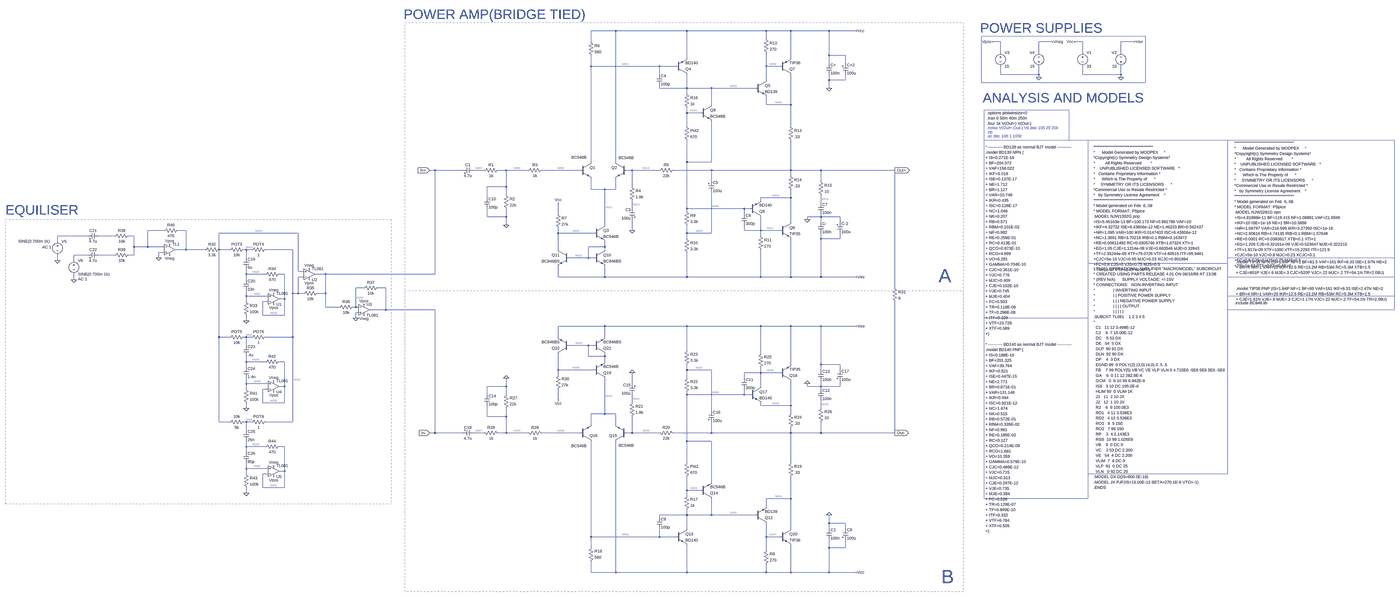
[diagram p0: schematic Draft2.asc, whole sheet]
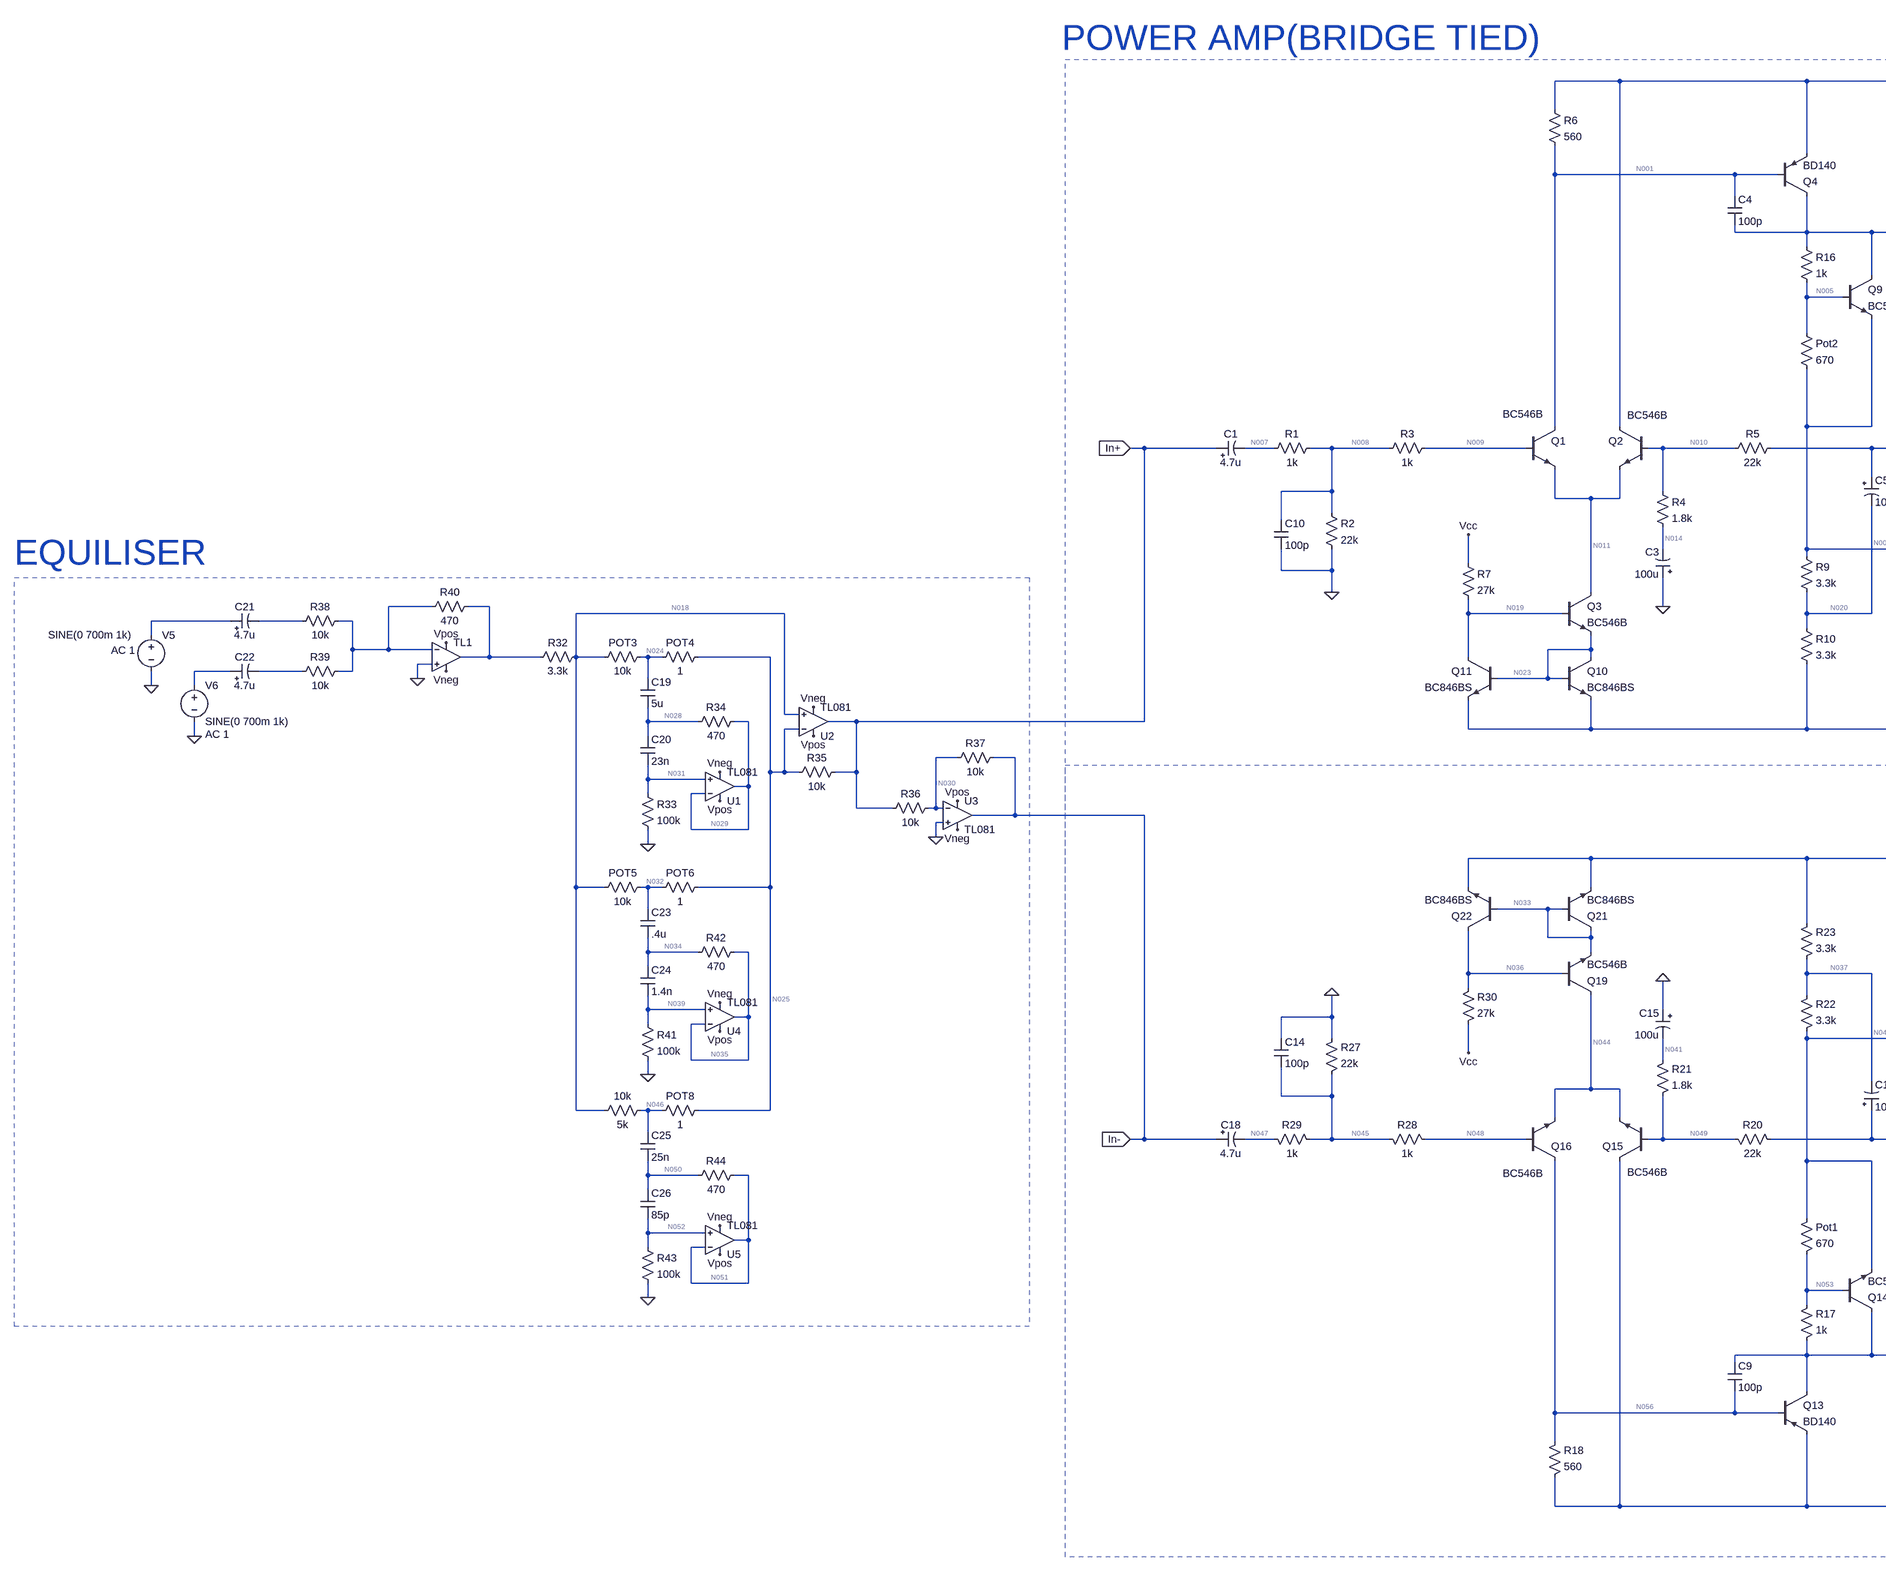
[diagram p1: schematic Draft2.asc, part, row 1 of 1, column 1 of 2]
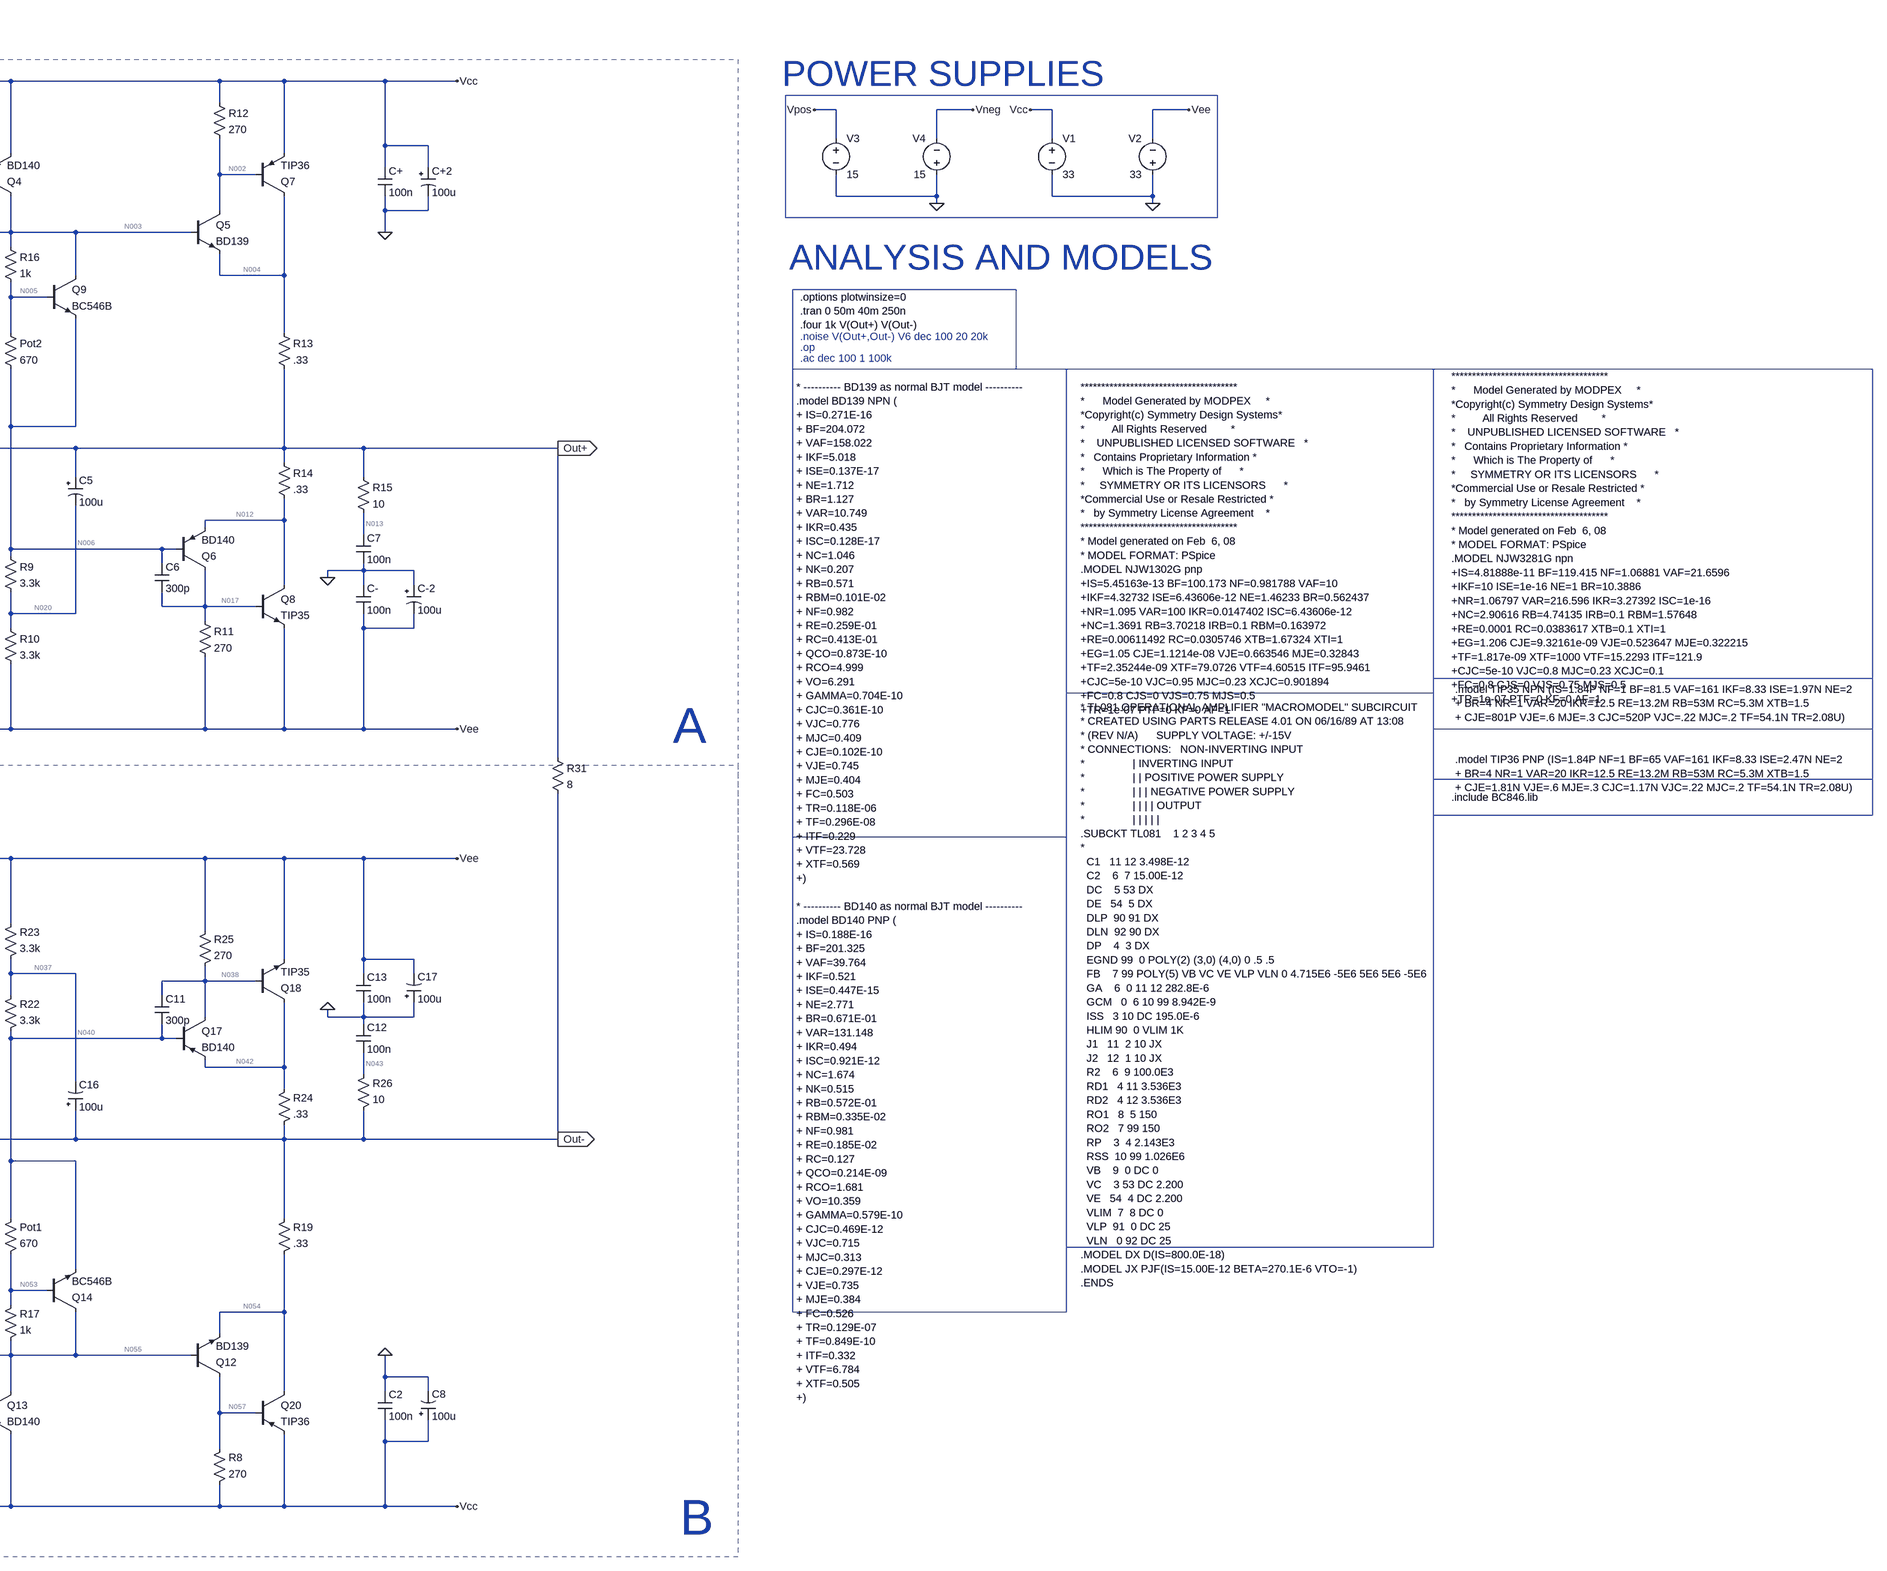
[diagram p2: schematic Draft2.asc, part, row 1 of 1, column 2 of 2]
Draft2.asc, the LTspice schematic file:
Version 4.1
SHEET 1 4540 4040
WIRE -1200 -144 -1344 -144
WIRE -784 -144 -1200 -144
WIRE -320 -144 -784 -144
WIRE -176 -144 -320 -144
WIRE 48 -144 -176 -144
WIRE 208 -144 48 -144
WIRE -320 -96 -320 -144
WIRE -1344 -80 -1344 -144
WIRE 1120 -80 1072 -80
WIRE 1424 -80 1344 -80
WIRE 1600 -80 1552 -80
WIRE 1904 -80 1824 -80
WIRE 1120 -16 1120 -80
WIRE 1344 -16 1344 -80
WIRE 1600 -16 1600 -80
WIRE 1824 -16 1824 -80
WIRE 48 0 48 -144
WIRE 144 0 48 0
WIRE -784 16 -784 -144
WIRE -176 16 -176 -144
WIRE 48 48 48 0
WIRE 144 48 144 0
WIRE -1344 64 -1344 0
WIRE -944 64 -1344 64
WIRE -848 64 -944 64
WIRE -320 64 -320 -16
WIRE -240 64 -320 64
WIRE -944 112 -944 64
WIRE 1120 112 1120 64
WIRE 1344 112 1344 64
WIRE 1344 112 1120 112
WIRE 1600 112 1600 64
WIRE 1824 112 1824 64
WIRE 1824 112 1600 112
WIRE 1344 128 1344 112
WIRE 1824 128 1824 112
WIRE -320 144 -320 64
WIRE 48 144 48 112
WIRE 144 144 144 112
WIRE 144 144 48 144
WIRE -944 192 -944 176
WIRE -784 192 -784 112
WIRE -784 192 -944 192
WIRE -640 192 -784 192
WIRE -384 192 -640 192
WIRE 48 192 48 144
WIRE -784 224 -784 192
WIRE -640 288 -640 192
WIRE -320 288 -320 240
WIRE -176 288 -176 112
WIRE -176 288 -320 288
WIRE -784 336 -784 304
WIRE -704 336 -784 336
WIRE -784 416 -784 336
WIRE -176 416 -176 288
WIRE -1344 624 -1344 64
WIRE -1200 624 -1200 -144
WIRE -784 624 -784 496
WIRE -640 624 -640 384
WIRE -640 624 -784 624
WIRE -2256 672 -2288 672
WIRE -2096 672 -2256 672
WIRE -1968 672 -2032 672
WIRE -1840 672 -1888 672
WIRE -1712 672 -1840 672
WIRE -1408 672 -1632 672
WIRE -1104 672 -1136 672
WIRE -944 672 -1104 672
WIRE -640 672 -864 672
WIRE -176 672 -176 496
WIRE -176 672 -640 672
WIRE 0 672 -176 672
WIRE 432 672 0 672
WIRE -176 704 -176 672
WIRE -640 736 -640 672
WIRE 0 736 0 672
WIRE -1840 768 -1840 672
WIRE -1840 768 -1952 768
WIRE -1104 768 -1104 672
WIRE -1344 784 -1344 720
WIRE -1264 784 -1344 784
WIRE -1200 784 -1200 720
WIRE -1200 784 -1264 784
WIRE -1840 816 -1840 768
WIRE -1952 832 -1952 768
WIRE -176 832 -176 784
WIRE -176 832 -352 832
WIRE -352 848 -352 832
WIRE 0 864 0 816
WIRE -1104 896 -1104 848
WIRE -784 896 -784 624
WIRE -448 896 -784 896
WIRE -416 896 -448 896
WIRE -784 912 -784 896
WIRE -1536 928 -1536 864
WIRE -448 928 -448 896
WIRE -1952 944 -1952 896
WIRE -1840 944 -1840 896
WIRE -1840 944 -1952 944
WIRE 0 944 0 928
WIRE 0 944 -80 944
WIRE 112 944 0 944
WIRE -80 960 -80 944
WIRE -176 976 -176 832
WIRE 0 976 0 944
WIRE 112 976 112 944
WIRE -1840 992 -1840 944
WIRE -1264 992 -1264 784
WIRE -3840 1024 -3936 1024
WIRE -3712 1024 -3760 1024
WIRE -1104 1024 -1104 960
WIRE -448 1024 -448 992
WIRE -352 1024 -352 944
WIRE -352 1024 -448 1024
WIRE -240 1024 -352 1024
WIRE -3056 1040 -3520 1040
WIRE -1536 1040 -1536 1008
WIRE -1328 1040 -1536 1040
WIRE -784 1040 -784 992
WIRE -640 1040 -640 800
WIRE -640 1040 -784 1040
WIRE -4288 1056 -4464 1056
WIRE -4128 1056 -4224 1056
WIRE -4016 1056 -4048 1056
WIRE -352 1056 -352 1024
WIRE -784 1072 -784 1040
WIRE 0 1072 0 1040
WIRE 112 1072 112 1040
WIRE 112 1072 0 1072
WIRE -4464 1088 -4464 1056
WIRE -4016 1120 -4016 1056
WIRE -3936 1120 -3936 1024
WIRE -3936 1120 -4016 1120
WIRE -3840 1120 -3936 1120
WIRE -1264 1120 -1264 1088
WIRE -1264 1120 -1360 1120
WIRE -3712 1136 -3712 1024
WIRE -3712 1136 -3776 1136
WIRE -3600 1136 -3712 1136
WIRE -3520 1136 -3520 1040
WIRE -3456 1136 -3520 1136
WIRE -3360 1136 -3376 1136
WIRE -3328 1136 -3360 1136
WIRE -3088 1136 -3248 1136
WIRE -1536 1136 -1536 1040
WIRE -1264 1136 -1264 1120
WIRE -3840 1152 -3872 1152
WIRE -4288 1168 -4368 1168
WIRE -4128 1168 -4224 1168
WIRE -4016 1168 -4016 1120
WIRE -4016 1168 -4048 1168
WIRE -3872 1184 -3872 1152
WIRE -3360 1184 -3360 1136
WIRE -1360 1184 -1360 1120
WIRE -1360 1184 -1472 1184
WIRE -1328 1184 -1360 1184
WIRE -4464 1200 -4464 1168
WIRE -4368 1200 -4368 1168
WIRE -3056 1264 -3056 1040
WIRE -3024 1264 -3056 1264
WIRE -3360 1280 -3360 1248
WIRE -3248 1280 -3360 1280
WIRE -3136 1280 -3168 1280
WIRE -2896 1280 -2960 1280
WIRE -2256 1280 -2256 672
WIRE -2256 1280 -2896 1280
WIRE -3024 1296 -3056 1296
WIRE -1536 1296 -1536 1232
WIRE -1264 1296 -1264 1232
WIRE -1264 1296 -1536 1296
WIRE -784 1296 -784 1152
WIRE -784 1296 -1264 1296
WIRE -352 1296 -352 1136
WIRE -352 1296 -784 1296
WIRE -176 1296 -176 1072
WIRE -176 1296 -352 1296
WIRE 0 1296 0 1072
WIRE 0 1296 -176 1296
WIRE 208 1296 0 1296
WIRE -4368 1312 -4368 1280
WIRE -3360 1312 -3360 1280
WIRE -2672 1360 -2720 1360
WIRE -2544 1360 -2592 1360
WIRE 432 1360 432 672
WIRE -3088 1392 -3088 1136
WIRE -3056 1392 -3056 1296
WIRE -3056 1392 -3088 1392
WIRE -3024 1392 -3056 1392
WIRE -2896 1392 -2896 1280
WIRE -2896 1392 -2944 1392
WIRE -3360 1408 -3360 1376
WIRE -3232 1408 -3360 1408
WIRE -3136 1424 -3136 1280
WIRE -3136 1424 -3168 1424
WIRE -3360 1440 -3360 1408
WIRE -3232 1440 -3264 1440
WIRE -2896 1472 -2896 1392
WIRE -2816 1472 -2896 1472
WIRE -2720 1472 -2720 1360
WIRE -2720 1472 -2736 1472
WIRE -2704 1472 -2720 1472
WIRE -2544 1488 -2544 1360
WIRE -2544 1488 -2640 1488
WIRE -2256 1488 -2544 1488
WIRE -2704 1504 -2720 1504
WIRE -3264 1520 -3264 1440
WIRE -3136 1520 -3136 1424
WIRE -3136 1520 -3264 1520
WIRE -2720 1536 -2720 1504
WIRE -3360 1552 -3360 1520
WIRE -1264 1584 -1536 1584
WIRE -784 1584 -1264 1584
WIRE -352 1584 -784 1584
WIRE -176 1584 -352 1584
WIRE 0 1584 -176 1584
WIRE 208 1584 0 1584
WIRE -3520 1648 -3520 1136
WIRE -3456 1648 -3520 1648
WIRE -3360 1648 -3376 1648
WIRE -3328 1648 -3360 1648
WIRE -3088 1648 -3088 1392
WIRE -3088 1648 -3248 1648
WIRE -1536 1648 -1536 1584
WIRE -1264 1648 -1264 1584
WIRE -3360 1696 -3360 1648
WIRE -1360 1696 -1472 1696
WIRE -1328 1696 -1360 1696
WIRE -784 1728 -784 1584
WIRE -352 1744 -352 1584
WIRE -1360 1760 -1360 1696
WIRE -1264 1760 -1264 1744
WIRE -1264 1760 -1360 1760
WIRE -3360 1792 -3360 1760
WIRE -3248 1792 -3360 1792
WIRE -3136 1792 -3168 1792
WIRE -1264 1792 -1264 1760
WIRE -176 1808 -176 1584
WIRE 0 1808 0 1584
WIRE 112 1808 0 1808
WIRE -3360 1824 -3360 1792
WIRE -1536 1840 -1536 1744
WIRE -1328 1840 -1536 1840
WIRE -784 1840 -784 1808
WIRE -640 1840 -784 1840
WIRE 0 1840 0 1808
WIRE 112 1840 112 1808
WIRE -352 1856 -352 1824
WIRE -352 1856 -448 1856
WIRE -240 1856 -352 1856
WIRE -1536 1872 -1536 1840
WIRE -784 1888 -784 1840
WIRE -448 1888 -448 1856
WIRE -3360 1920 -3360 1888
WIRE -3232 1920 -3360 1920
WIRE -1104 1920 -1104 1856
WIRE -3136 1936 -3136 1792
WIRE -3136 1936 -3168 1936
WIRE -1840 1936 -1840 1888
WIRE -1840 1936 -1952 1936
WIRE -352 1936 -352 1856
WIRE -80 1936 -80 1920
WIRE 0 1936 0 1904
WIRE 0 1936 -80 1936
WIRE 112 1936 112 1904
WIRE 112 1936 0 1936
WIRE -3360 1952 -3360 1920
WIRE -3232 1952 -3264 1952
WIRE 0 1952 0 1936
WIRE -1952 1984 -1952 1936
WIRE -1840 1984 -1840 1936
WIRE -784 1984 -784 1968
WIRE -448 1984 -448 1952
WIRE -448 1984 -784 1984
WIRE -416 1984 -448 1984
WIRE -1536 2016 -1536 1952
WIRE -3264 2032 -3264 1952
WIRE -3136 2032 -3136 1936
WIRE -3136 2032 -3264 2032
WIRE -1104 2032 -1104 1984
WIRE -352 2048 -352 2032
WIRE -176 2048 -176 1904
WIRE -176 2048 -352 2048
WIRE -3360 2064 -3360 2032
WIRE 0 2064 0 2016
WIRE -640 2080 -640 1840
WIRE -1264 2096 -1264 1888
WIRE -1264 2096 -1344 2096
WIRE -1200 2096 -1264 2096
WIRE -176 2096 -176 2048
WIRE -1952 2112 -1952 2048
WIRE -1840 2112 -1840 2064
WIRE -1840 2112 -1952 2112
WIRE -3520 2144 -3520 1648
WIRE -3456 2144 -3520 2144
WIRE -3360 2144 -3376 2144
WIRE -3328 2144 -3360 2144
WIRE -3088 2144 -3088 1648
WIRE -3088 2144 -3248 2144
WIRE -1344 2160 -1344 2096
WIRE -1200 2160 -1200 2096
WIRE -3360 2192 -3360 2144
WIRE -2256 2208 -2256 1488
WIRE -2256 2208 -2288 2208
WIRE -2096 2208 -2256 2208
WIRE -1968 2208 -2032 2208
WIRE -1840 2208 -1840 2112
WIRE -1840 2208 -1888 2208
WIRE -1712 2208 -1840 2208
WIRE -1408 2208 -1632 2208
WIRE -1104 2208 -1104 2112
WIRE -1104 2208 -1136 2208
WIRE -944 2208 -1104 2208
WIRE -640 2208 -640 2144
WIRE -640 2208 -864 2208
WIRE -176 2208 -176 2176
WIRE -176 2208 -640 2208
WIRE 0 2208 0 2144
WIRE 0 2208 -176 2208
WIRE 432 2208 432 1440
WIRE 432 2208 0 2208
WIRE -784 2256 -784 1984
WIRE -640 2256 -784 2256
WIRE -3360 2288 -3360 2256
WIRE -3248 2288 -3360 2288
WIRE -3136 2288 -3168 2288
WIRE -3360 2320 -3360 2288
WIRE -784 2384 -784 2256
WIRE -176 2384 -176 2208
WIRE -3360 2416 -3360 2384
WIRE -3232 2416 -3360 2416
WIRE -3136 2432 -3136 2288
WIRE -3136 2432 -3168 2432
WIRE -3360 2448 -3360 2416
WIRE -3232 2448 -3264 2448
WIRE -640 2496 -640 2256
WIRE -3264 2528 -3264 2448
WIRE -3136 2528 -3136 2432
WIRE -3136 2528 -3264 2528
WIRE -784 2544 -784 2464
WIRE -704 2544 -784 2544
WIRE -3360 2560 -3360 2528
WIRE -784 2576 -784 2544
WIRE -176 2592 -176 2464
WIRE -176 2592 -320 2592
WIRE -320 2640 -320 2592
WIRE -784 2688 -784 2656
WIRE -784 2688 -944 2688
WIRE -640 2688 -640 2592
WIRE -640 2688 -784 2688
WIRE -384 2688 -640 2688
WIRE -944 2704 -944 2688
WIRE 48 2736 48 2688
WIRE 144 2736 48 2736
WIRE -784 2768 -784 2688
WIRE -176 2768 -176 2592
WIRE 48 2768 48 2736
WIRE 144 2768 144 2736
WIRE -1344 2816 -1344 2256
WIRE -944 2816 -944 2768
WIRE -944 2816 -1344 2816
WIRE -848 2816 -944 2816
WIRE -320 2816 -320 2736
WIRE -240 2816 -320 2816
WIRE -1344 2880 -1344 2816
WIRE 48 2880 48 2832
WIRE 144 2880 144 2832
WIRE 144 2880 48 2880
WIRE -320 2896 -320 2816
WIRE -1344 3024 -1344 2960
WIRE -1200 3024 -1200 2256
WIRE -1200 3024 -1344 3024
WIRE -784 3024 -784 2864
WIRE -784 3024 -1200 3024
WIRE -320 3024 -320 2976
WIRE -320 3024 -784 3024
WIRE -176 3024 -176 2864
WIRE -176 3024 -320 3024
WIRE 48 3024 48 2880
WIRE 48 3024 -176 3024
WIRE 208 3024 48 3024
FLAG 48 192 0
FLAG 208 -144 Vcc
FLAG -1104 1024 0
FLAG 432 672 Out+
IOPIN 432 672 Out
FLAG -80 960 0
FLAG 208 1296 Vee
FLAG -1840 992 0
FLAG -2288 672 In+
IOPIN -2288 672 In
FLAG 1824 128 0
FLAG 1552 -80 Vcc
FLAG 1904 -80 Vee
FLAG -1536 864 Vcc
FLAG 48 2688 0
FLAG 208 3024 Vcc
FLAG -1104 1856 0
FLAG -80 1920 0
FLAG 208 1584 Vee
FLAG -1840 1888 0
FLAG -1536 2016 Vcc
FLAG 432 2208 Out-
IOPIN 432 2208 Out
FLAG 1344 128 0
FLAG 1072 -80 Vpos
FLAG 1424 -80 Vneg
FLAG -2288 2208 In-
IOPIN -2288 2208 In
FLAG -3360 1552 0
FLAG -3200 1392 Vneg
FLAG -2992 1248 Vneg
FLAG -3200 1456 Vpos
FLAG -2992 1312 Vpos
FLAG -2672 1456 Vpos
FLAG -2672 1520 Vneg
FLAG -2720 1536 0
FLAG -4464 1200 0
FLAG -4368 1312 0
FLAG -3872 1184 0
FLAG -3808 1104 Vpos
FLAG -3808 1168 Vneg
FLAG -3360 2064 0
FLAG -3200 1904 Vneg
FLAG -3200 1968 Vpos
FLAG -3360 2560 0
FLAG -3200 2400 Vneg
FLAG -3200 2464 Vpos
DATAFLAG -176 368 ""
DATAFLAG -176 800 ""
DATAFLAG -64 672 ""
DATAFLAG -176 2512 ""
DATAFLAG -176 2080 ""
DATAFLAG -64 2208 ""
SYMBOL cap 32 48 R0
SYMATTR InstName C+
SYMATTR Value 100n
SYMBOL polcap 128 48 R0
SYMATTR InstName C+2
SYMATTR Value 100u
SYMBOL npn -384 144 R0
SYMATTR InstName Q5
SYMATTR Value BD139
SYMBOL res -336 -112 R0
SYMATTR InstName R12
SYMATTR Value 270
SYMATTR SpiceLine tol=5
SYMBOL pnp -848 112 M180
SYMATTR InstName Q4
SYMATTR Value BD140
SYMBOL npn -704 288 R0
SYMATTR InstName Q9
SYMATTR Value BC546B
SYMBOL res -800 208 R0
SYMATTR InstName R16
SYMATTR Value 1k
SYMATTR SpiceLine tol=5
SYMBOL res -800 400 R0
SYMATTR InstName Pot2
SYMATTR Value 670
SYMBOL cap -960 112 R0
SYMATTR InstName C4
SYMATTR Value 100p
SYMBOL res -1360 -96 R0
SYMATTR InstName R6
SYMATTR Value 560
SYMATTR SpiceLine tol=5
SYMBOL res -192 400 R0
SYMATTR InstName R13
SYMATTR Value .33
SYMBOL res -848 656 R90
WINDOW 0 0 56 VBottom 2
WINDOW 3 32 56 VTop 2
SYMATTR InstName R5
SYMATTR Value 22k
SYMATTR SpiceLine tol=5
SYMBOL npn -1136 624 M0
WINDOW 3 -42 -25 Left 2
SYMATTR Value BC546B
SYMATTR InstName Q2
SYMBOL npn -1408 624 R0
WINDOW 3 -52 -28 Left 2
SYMATTR Value BC546B
SYMATTR InstName Q1
SYMBOL res -1120 752 R0
SYMATTR InstName R4
SYMATTR Value 1.8k
SYMATTR SpiceLine tol=5
SYMBOL res -800 896 R0
SYMATTR InstName R9
SYMATTR Value 3.3k
SYMATTR SpiceLine tol=5
SYMBOL res -800 1056 R0
SYMATTR InstName R10
SYMATTR Value 3.3k
SYMATTR SpiceLine tol=5
SYMBOL pnp -416 944 M180
SYMATTR InstName Q6
SYMATTR Value BD140
SYMBOL cap -464 928 R0
SYMATTR InstName C6
SYMATTR Value 300p
SYMBOL res -192 688 R0
SYMATTR InstName R14
SYMATTR Value .33
SYMBOL npn -240 976 R0
SYMATTR InstName Q8
SYMATTR Value TIP35
SYMBOL res -368 1040 R0
SYMATTR InstName R11
SYMATTR Value 270
SYMATTR SpiceLine tol=5
SYMBOL res -16 720 R0
SYMATTR InstName R15
SYMATTR Value 10
SYMBOL cap -16 864 R0
SYMATTR InstName C7
SYMATTR Value 100n
SYMBOL cap -16 976 R0
SYMATTR InstName C-
SYMATTR Value 100n
SYMBOL npn -1328 992 R0
SYMATTR InstName Q3
SYMATTR Value BC546B
SYMBOL res -1856 800 R0
SYMATTR InstName R2
SYMATTR Value 22k
SYMATTR SpiceLine tol=5
SYMBOL res -1616 656 R90
WINDOW 0 0 56 VBottom 2
WINDOW 3 32 56 VTop 2
SYMATTR InstName R3
SYMATTR Value 1k
SYMATTR SpiceLine tol=5
SYMBOL cap -1968 832 R0
SYMATTR InstName C10
SYMATTR Value 100p
SYMBOL res -1872 656 R90
WINDOW 0 0 56 VBottom 2
WINDOW 3 32 56 VTop 2
SYMATTR InstName R1
SYMATTR Value 1k
SYMATTR SpiceLine tol=5
SYMBOL polcap -1088 960 R180
WINDOW 0 24 57 Left 2
WINDOW 3 24 8 Left 2
SYMATTR InstName C3
SYMATTR Value 100u
SYMBOL polcap -656 736 R0
SYMATTR InstName C5
SYMATTR Value 100u
SYMBOL polcap 96 976 R0
SYMATTR InstName C-2
SYMATTR Value 100u
SYMBOL voltage 1600 -32 R0
WINDOW 123 0 0 Left 0
WINDOW 39 0 0 Left 0
SYMATTR InstName V1
SYMATTR Value 33
SYMBOL voltage 1824 80 R180
WINDOW 0 24 96 Left 2
WINDOW 3 24 16 Left 2
WINDOW 123 0 0 Left 0
WINDOW 39 0 0 Left 0
SYMATTR InstName V2
SYMATTR Value 33
SYMBOL pnp -240 112 M180
SYMATTR InstName Q7
SYMATTR Value TIP36
SYMBOL polcap -2096 688 R270
WINDOW 0 32 32 VTop 2
WINDOW 3 0 32 VBottom 2
SYMATTR InstName C1
SYMATTR Value 4.7u
SYMBOL npn -1328 1136 R0
SYMATTR InstName Q10
SYMATTR Value BC846BS
SYMATTR Prefix X
SYMBOL npn -1472 1136 M0
SYMATTR InstName Q11
SYMATTR Value BC846BS
SYMATTR Prefix X
SYMBOL res -1552 912 R0
SYMATTR InstName R7
SYMATTR Value 27k
SYMATTR SpiceLine tol=5
SYMBOL cap 32 2832 M180
WINDOW 0 24 56 Left 2
WINDOW 3 24 8 Left 2
SYMATTR InstName C2
SYMATTR Value 100n
SYMBOL polcap 128 2832 M180
WINDOW 0 24 57 Left 2
WINDOW 3 24 8 Left 2
SYMATTR InstName C8
SYMATTR Value 100u
SYMBOL npn -384 2736 M180
SYMATTR InstName Q12
SYMATTR Value BD139
SYMBOL res -336 2992 M180
WINDOW 0 36 76 Left 2
WINDOW 3 36 40 Left 2
SYMATTR InstName R8
SYMATTR Value 270
SYMATTR SpiceLine tol=5
SYMBOL pnp -848 2768 R0
SYMATTR InstName Q13
SYMATTR Value BD140
SYMBOL npn -704 2592 M180
SYMATTR InstName Q14
SYMATTR Value BC546B
SYMBOL res -800 2672 M180
WINDOW 0 36 76 Left 2
WINDOW 3 36 40 Left 2
SYMATTR InstName R17
SYMATTR Value 1k
SYMATTR SpiceLine tol=5
SYMBOL res -800 2480 M180
WINDOW 0 36 76 Left 2
WINDOW 3 36 40 Left 2
SYMATTR InstName Pot1
SYMATTR Value 670
SYMBOL cap -960 2768 M180
WINDOW 0 24 56 Left 2
WINDOW 3 24 8 Left 2
SYMATTR InstName C9
SYMATTR Value 100p
SYMBOL res -1360 2976 M180
WINDOW 0 36 76 Left 2
WINDOW 3 36 40 Left 2
SYMATTR InstName R18
SYMATTR Value 560
SYMATTR SpiceLine tol=5
SYMBOL res -192 2480 M180
WINDOW 0 36 76 Left 2
WINDOW 3 36 40 Left 2
SYMATTR InstName R19
SYMATTR Value .33
SYMBOL res -848 2224 M270
WINDOW 0 32 56 VTop 2
WINDOW 3 0 56 VBottom 2
SYMATTR InstName R20
SYMATTR Value 22k
SYMBOL npn -1136 2256 R180
WINDOW 3 -42 -25 Left 2
SYMATTR Value BC546B
SYMATTR InstName Q15
SYMBOL npn -1408 2256 M180
WINDOW 3 -52 -28 Left 2
SYMATTR Value BC546B
SYMATTR InstName Q16
SYMBOL res -1120 2128 M180
WINDOW 0 36 76 Left 2
WINDOW 3 36 40 Left 2
SYMATTR InstName R21
SYMATTR Value 1.8k
SYMATTR SpiceLine tol=5
SYMBOL res -800 1984 M180
WINDOW 0 36 76 Left 2
WINDOW 3 36 40 Left 2
SYMATTR InstName R22
SYMATTR Value 3.3k
SYMATTR SpiceLine tol=5
SYMBOL res -800 1824 M180
WINDOW 0 36 76 Left 2
WINDOW 3 36 40 Left 2
SYMATTR InstName R23
SYMATTR Value 3.3k
SYMATTR SpiceLine tol=5
SYMBOL pnp -416 1936 R0
SYMATTR InstName Q17
SYMATTR Value BD140
SYMBOL cap -464 1952 M180
WINDOW 0 24 56 Left 2
WINDOW 3 24 8 Left 2
SYMATTR InstName C11
SYMATTR Value 300p
SYMBOL res -192 2192 M180
WINDOW 0 36 76 Left 2
WINDOW 3 36 40 Left 2
SYMATTR InstName R24
SYMATTR Value .33
SYMBOL npn -240 1904 M180
SYMATTR InstName Q18
SYMATTR Value TIP35
SYMBOL res -368 1840 M180
WINDOW 0 36 76 Left 2
WINDOW 3 36 40 Left 2
SYMATTR InstName R25
SYMATTR Value 270
SYMATTR SpiceLine tol=5
SYMBOL res -16 2160 M180
WINDOW 0 36 76 Left 2
WINDOW 3 36 40 Left 2
SYMATTR InstName R26
SYMATTR Value 10
SYMBOL cap -16 2016 M180
WINDOW 0 24 56 Left 2
WINDOW 3 24 8 Left 2
SYMATTR InstName C12
SYMATTR Value 100n
SYMBOL cap -16 1904 M180
WINDOW 0 24 56 Left 2
WINDOW 3 24 8 Left 2
SYMATTR InstName C13
SYMATTR Value 100n
SYMBOL npn -1328 1888 M180
SYMATTR InstName Q19
SYMATTR Value BC546B
SYMBOL res -1856 2080 M180
WINDOW 0 36 76 Left 2
WINDOW 3 36 40 Left 2
SYMATTR InstName R27
SYMATTR Value 22k
SYMATTR SpiceLine tol=5
SYMBOL res -1616 2224 M270
WINDOW 0 32 56 VTop 2
WINDOW 3 0 56 VBottom 2
SYMATTR InstName R28
SYMATTR Value 1k
SYMATTR SpiceLine tol=5
SYMBOL cap -1968 2048 M180
WINDOW 0 24 56 Left 2
WINDOW 3 24 8 Left 2
SYMATTR InstName C14
SYMATTR Value 100p
SYMBOL res -1872 2224 M270
WINDOW 0 32 56 VTop 2
WINDOW 3 0 56 VBottom 2
SYMATTR InstName R29
SYMATTR Value 1k
SYMATTR SpiceLine tol=5
SYMBOL polcap -1088 1920 M0
SYMATTR InstName C15
SYMATTR Value 100u
SYMBOL polcap -656 2144 M180
WINDOW 0 24 57 Left 2
WINDOW 3 24 8 Left 2
SYMATTR InstName C16
SYMATTR Value 100u
SYMBOL polcap 96 1904 M180
WINDOW 0 24 57 Left 2
WINDOW 3 24 8 Left 2
SYMATTR InstName C17
SYMATTR Value 100u
SYMBOL pnp -240 2768 R0
SYMATTR InstName Q20
SYMATTR Value TIP36
SYMBOL polcap -2096 2192 M90
WINDOW 0 0 32 VBottom 2
WINDOW 3 32 32 VTop 2
SYMATTR InstName C18
SYMATTR Value 4.7u
SYMBOL npn -1328 1744 M180
SYMATTR InstName Q21
SYMATTR Value BC846BS
SYMATTR Prefix X
SYMBOL npn -1472 1744 R180
SYMATTR InstName Q22
SYMATTR Value BC846BS
SYMATTR Prefix X
SYMBOL res -1552 1968 M180
WINDOW 0 36 76 Left 2
WINDOW 3 36 40 Left 2
SYMATTR InstName R30
SYMATTR Value 27k
SYMATTR SpiceLine tol=5
SYMBOL res 416 1344 R0
SYMATTR InstName R31
SYMATTR Value 8
SYMBOL voltage 1120 -32 R0
WINDOW 123 0 0 Left 0
WINDOW 39 0 0 Left 0
SYMATTR InstName V3
SYMATTR Value 15
SYMBOL voltage 1344 80 R180
WINDOW 0 24 96 Left 2
WINDOW 3 24 16 Left 2
WINDOW 123 0 0 Left 0
WINDOW 39 0 0 Left 0
SYMATTR InstName V4
SYMATTR Value 15
SYMBOL res -3504 1120 R90
WINDOW 0 0 56 VBottom 2
WINDOW 3 32 56 VTop 2
SYMATTR InstName R32
SYMATTR Value 3.3k
SYMATTR SpiceLine tol=5
SYMBOL res -3360 1120 R90
WINDOW 0 0 56 VBottom 2
WINDOW 3 32 56 VTop 2
SYMATTR InstName POT3
SYMATTR Value 10k
SYMBOL res -3232 1120 R90
WINDOW 0 0 56 VBottom 2
WINDOW 3 32 56 VTop 2
SYMATTR InstName POT4
SYMATTR Value 1
SYMBOL cap -3376 1184 R0
SYMATTR InstName C19
SYMATTR Value 5u
SYMBOL cap -3376 1312 R0
SYMATTR InstName C20
SYMATTR Value 23n
SYMBOL res -3376 1424 R0
SYMATTR InstName R33
SYMATTR Value 100k
SYMBOL res -3152 1264 R90
WINDOW 0 0 56 VBottom 2
WINDOW 3 32 56 VTop 2
SYMATTR InstName R34
SYMATTR Value 470
SYMATTR SpiceLine tol=5
SYMBOL res -2928 1376 R90
WINDOW 0 0 56 VBottom 2
WINDOW 3 32 56 VTop 2
SYMATTR InstName R35
SYMATTR Value 10k
SYMBOL OpAmps\\opamp2 -3200 1488 M180
SYMATTR InstName U1
SYMATTR Value TL081
SYMBOL OpAmps\\opamp2 -2992 1344 M180
SYMATTR InstName U2
SYMATTR Value TL081
SYMBOL OpAmps\\opamp2 -2672 1424 R0
SYMATTR InstName U3
SYMATTR Value TL081
SYMBOL res -2720 1456 R90
WINDOW 0 0 56 VBottom 2
WINDOW 3 32 56 VTop 2
SYMATTR InstName R36
SYMATTR Value 10k
SYMATTR SpiceLine tol=5
SYMBOL res -2576 1344 R90
WINDOW 0 0 56 VBottom 2
WINDOW 3 32 56 VTop 2
SYMATTR InstName R37
SYMATTR Value 10k
SYMATTR SpiceLine tol=5
SYMBOL voltage -4464 1072 R0
WINDOW 3 -229 15 Left 2
WINDOW 123 -89 49 Left 2
WINDOW 39 0 0 Left 0
SYMATTR Value SINE(0 700m 1k)
SYMATTR Value2 AC 1
SYMATTR InstName V5
SYMBOL voltage -4368 1184 R0
WINDOW 123 24 124 Left 2
WINDOW 39 0 0 Left 0
SYMATTR Value2 AC 1
SYMATTR InstName V6
SYMATTR Value SINE(0 700m 1k)
SYMBOL polcap -4288 1072 R270
WINDOW 0 32 32 VTop 2
WINDOW 3 0 32 VBottom 2
SYMATTR InstName C21
SYMATTR Value 4.7u
SYMBOL polcap -4288 1184 R270
WINDOW 0 32 32 VTop 2
WINDOW 3 0 32 VBottom 2
SYMATTR InstName C22
SYMATTR Value 4.7u
SYMBOL res -4032 1040 R90
WINDOW 0 0 56 VBottom 2
WINDOW 3 32 56 VTop 2
SYMATTR InstName R38
SYMATTR Value 10k
SYMATTR SpiceLine tol=5
SYMBOL res -4032 1152 R90
WINDOW 0 0 56 VBottom 2
WINDOW 3 32 56 VTop 2
SYMATTR InstName R39
SYMATTR Value 10k
SYMATTR SpiceLine tol=5
SYMBOL OpAmps\\UniversalOpAmp2 -3808 1136 R0
SYMATTR InstName TL1
SYMBOL res -3744 1008 R90
WINDOW 0 0 56 VBottom 2
WINDOW 3 32 56 VTop 2
SYMATTR InstName R40
SYMATTR Value 470
SYMATTR SpiceLine tol=5
SYMBOL res -3360 1632 R90
WINDOW 0 0 56 VBottom 2
WINDOW 3 32 56 VTop 2
SYMATTR InstName POT5
SYMATTR Value 10k
SYMBOL res -3232 1632 R90
WINDOW 0 0 56 VBottom 2
WINDOW 3 32 56 VTop 2
SYMATTR InstName POT6
SYMATTR Value 1
SYMBOL cap -3376 1696 R0
SYMATTR InstName C23
SYMATTR Value .4u
SYMBOL cap -3376 1824 R0
SYMATTR InstName C24
SYMATTR Value 1.4n
SYMBOL res -3376 1936 R0
SYMATTR InstName R41
SYMATTR Value 100k
SYMBOL res -3152 1776 R90
WINDOW 0 0 56 VBottom 2
WINDOW 3 32 56 VTop 2
SYMATTR InstName R42
SYMATTR Value 470
SYMATTR SpiceLine tol=5
SYMBOL OpAmps\\opamp2 -3200 2000 M180
SYMATTR InstName U4
SYMATTR Value TL081
SYMBOL res -3360 2128 R90
WINDOW 0 0 56 VBottom 2
WINDOW 3 32 56 VTop 2
SYMATTR InstName 10k
SYMATTR Value 5k
SYMBOL res -3232 2128 R90
WINDOW 0 0 56 VBottom 2
WINDOW 3 32 56 VTop 2
SYMATTR InstName POT8
SYMATTR Value 1
SYMBOL cap -3376 2192 R0
SYMATTR InstName C25
SYMATTR Value 25n
SYMBOL cap -3376 2320 R0
SYMATTR InstName C26
SYMATTR Value 85p
SYMBOL res -3376 2432 R0
SYMATTR InstName R43
SYMATTR Value 100k
SYMBOL res -3152 2272 R90
WINDOW 0 0 56 VBottom 2
WINDOW 3 32 56 VTop 2
SYMATTR InstName R44
SYMATTR Value 470
SYMATTR SpiceLine tol=5
SYMBOL OpAmps\\opamp2 -3200 2496 M180
SYMATTR InstName U5
SYMATTR Value TL081
TEXT 2496 1208 Left 2 !.model TIP35 NPN (IS=1.84P NF=1 BF=81.5 VAF=161 IKF=8.33 ISE=1.97N NE=2\n+ BR=4 NR=1 VAR=20 IKR=12.5 RE=13.2M RB=53M RC=5.3M XTB=1.5\n+ CJE=801P VJE=.6 MJE=.3 CJC=520P VJC=.22 MJC=.2 TF=54.1N TR=2.08U)\n \n\n.model TIP36 PNP (IS=1.84P NF=1 BF=65 VAF=161 IKF=8.33 ISE=2.47N NE=2\n+ BR=4 NR=1 VAR=20 IKR=12.5 RE=13.2M RB=53M RC=5.3M XTB=1.5\n+ CJE=1.81N VJE=.6 MJE=.3 CJC=1.17N VJC=.22 MJC=.2 TF=54.1N TR=2.08U)
TEXT 1032 536 Left 2 !* ---------- BD139 as normal BJT model ----------\n.model BD139 NPN (\n+ IS=0.271E-16\n+ BF=204.072\n+ VAF=158.022\n+ IKF=5.018\n+ ISE=0.137E-17\n+ NE=1.712\n+ BR=1.127\n+ VAR=10.749\n+ IKR=0.435\n+ ISC=0.128E-17\n+ NC=1.046\n+ NK=0.207\n+ RB=0.571\n+ RBM=0.101E-02\n+ NF=0.982\n+ RE=0.259E-01\n+ RC=0.413E-01\n+ QCO=0.873E-10\n+ RCO=4.999\n+ VO=6.291\n+ GAMMA=0.704E-10\n+ CJC=0.361E-10\n+ VJC=0.776\n+ MJC=0.409\n+ CJE=0.102E-10\n+ VJE=0.745\n+ MJE=0.404\n+ FC=0.503\n+ TR=0.118E-06\n+ TF=0.296E-08\n+ ITF=0.229\n+ VTF=23.728\n+ XTF=0.569\n+)\n \n* ---------- BD140 as normal BJT model ----------\n.model BD140 PNP (\n+ IS=0.188E-16\n+ BF=201.325\n+ VAF=39.764\n+ IKF=0.521\n+ ISE=0.447E-15\n+ NE=2.771\n+ BR=0.671E-01\n+ VAR=131.148\n+ IKR=0.494\n+ ISC=0.921E-12\n+ NC=1.674\n+ NK=0.515\n+ RB=0.572E-01\n+ RBM=0.335E-02\n+ NF=0.981\n+ RE=0.185E-02\n+ RC=0.127\n+ QCO=0.214E-09\n+ RCO=1.681\n+ VO=10.359\n+ GAMMA=0.579E-10\n+ CJC=0.469E-12\n+ VJC=0.715\n+ MJC=0.313\n+ CJE=0.297E-12\n+ VJE=0.735\n+ MJE=0.384\n+ FC=0.526\n+ TR=0.129E-07\n+ TF=0.849E-10\n+ ITF=0.332\n+ VTF=6.784\n+ XTF=0.505\n+)
TEXT 1040 472 Left 2 ;.ac dec 100 1 100k
TEXT 2488 1448 Left 2 !.include BC846.lib
TEXT 1664 536 Left 2 !**************************************\n*      Model Generated by MODPEX     *\n*Copyright(c) Symmetry Design Systems*\n*         All Rights Reserved        *\n*    UNPUBLISHED LICENSED SOFTWARE   *\n*   Contains Proprietary Information *\n*      Which is The Property of      *\n*     SYMMETRY OR ITS LICENSORS      *\n*Commercial Use or Resale Restricted *\n*   by Symmetry License Agreement    *\n**************************************\n* Model generated on Feb  6, 08\n* MODEL FORMAT: PSpice\n.MODEL NJW1302G pnp\n+IS=5.45163e-13 BF=100.173 NF=0.981788 VAF=10\n+IKF=4.32732 ISE=6.43606e-12 NE=1.46233 BR=0.562437\n+NR=1.095 VAR=100 IKR=0.0147402 ISC=6.43606e-12\n+NC=1.3691 RB=3.70218 IRB=0.1 RBM=0.163972\n+RE=0.00611492 RC=0.0305746 XTB=1.67324 XTI=1\n+EG=1.05 CJE=1.1214e-08 VJE=0.663546 MJE=0.32843\n+TF=2.35244e-09 XTF=79.0726 VTF=4.60515 ITF=95.9461\n+CJC=5e-10 VJC=0.95 MJC=0.23 XCJC=0.901894\n+FC=0.8 CJS=0 VJS=0.75 MJS=0.5\n+TR=1e-07 PTF=0 KF=0 AF=1
TEXT 2488 512 Left 2 !**************************************\n*      Model Generated by MODPEX     *\n*Copyright(c) Symmetry Design Systems*\n*         All Rights Reserved        *\n*    UNPUBLISHED LICENSED SOFTWARE   *\n*   Contains Proprietary Information *\n*      Which is The Property of      *\n*     SYMMETRY OR ITS LICENSORS      *\n*Commercial Use or Resale Restricted *\n*   by Symmetry License Agreement    *\n**************************************\n* Model generated on Feb  6, 08\n* MODEL FORMAT: PSpice\n.MODEL NJW3281G npn\n+IS=4.81888e-11 BF=119.415 NF=1.06881 VAF=21.6596\n+IKF=10 ISE=1e-16 NE=1 BR=10.3886\n+NR=1.06797 VAR=216.596 IKR=3.27392 ISC=1e-16\n+NC=2.90616 RB=4.74135 IRB=0.1 RBM=1.57648\n+RE=0.0001 RC=0.0383617 XTB=0.1 XTI=1\n+EG=1.206 CJE=9.32161e-09 VJE=0.523647 MJE=0.322215\n+TF=1.817e-09 XTF=1000 VTF=15.2293 ITF=121.9\n+CJC=5e-10 VJC=0.8 MJC=0.23 XCJC=0.1\n+FC=0.8 CJS=0 VJS=0.75 MJS=0.5\n+TR=1e-07 PTF=0 KF=0 AF=1
TEXT 1664 1248 Left 2 !* TL081 OPERATIONAL AMPLIFIER "MACROMODEL" SUBCIRCUIT\n* CREATED USING PARTS RELEASE 4.01 ON 06/16/89 AT 13:08\n* (REV N/A)      SUPPLY VOLTAGE: +/-15V\n* CONNECTIONS:   NON-INVERTING INPUT\n*                | INVERTING INPUT\n*                | | POSITIVE POWER SUPPLY\n*                | | | NEGATIVE POWER SUPPLY\n*                | | | | OUTPUT\n*                | | | | |\n.SUBCKT TL081    1 2 3 4 5\n*\n  C1   11 12 3.498E-12\n  C2    6  7 15.00E-12\n  DC    5 53 DX\n  DE   54  5 DX\n  DLP  90 91 DX\n  DLN  92 90 DX\n  DP    4  3 DX\n  EGND 99  0 POLY(2) (3,0) (4,0) 0 .5 .5\n  FB    7 99 POLY(5) VB VC VE VLP VLN 0 4.715E6 -5E6 5E6 5E6 -5E6\n  GA    6  0 11 12 282.8E-6\n  GCM   0  6 10 99 8.942E-9\n  ISS   3 10 DC 195.0E-6\n  HLIM 90  0 VLIM 1K\n  J1   11  2 10 JX\n  J2   12  1 10 JX\n  R2    6  9 100.0E3\n  RD1   4 11 3.536E3\n  RD2   4 12 3.536E3\n  RO1   8  5 150\n  RO2   7 99 150\n  RP    3  4 2.143E3\n  RSS  10 99 1.026E6\n  VB    9  0 DC 0\n  VC    3 53 DC 2.200\n  VE   54  4 DC 2.200\n  VLIM  7  8 DC 0\n  VLP  91  0 DC 25\n  VLN   0 92 DC 25\n.MODEL DX D(IS=800.0E-18)\n.MODEL JX PJF(IS=15.00E-12 BETA=270.1E-6 VTO=-1)\n.ENDS
TEXT 1040 336 Left 2 !.options plotwinsize=0\n.tran 0 50m 40m 250n\n.four 1k V(Out+) V(Out-)
TEXT 1040 424 Left 2 ;.noise V(Out+,Out-) V6 dec 100 20 20k
TEXT 1040 448 Left 2 ;.op
TEXT -4768 904 Left 6 ;EQUILISER
TEXT 1016 248 Left 6 ;ANALYSIS AND MODELS
TEXT 1000 -160 Left 6 ;POWER SUPPLIES
TEXT -2440 -240 Left 6 ;POWER AMP(BRIDGE TIED)
TEXT 688 1288 Left 7 ;A
TEXT 704 3048 Left 7 ;B
RECTANGLE Normal -2512 2624 -4768 960 3
RECTANGLE Normal 1520 496 1024 320
RECTANGLE Normal 1632 1536 1024 496
RECTANGLE Normal 1632 2592 1024 1536
RECTANGLE Normal 2448 1216 1632 496
RECTANGLE Normal 2448 2448 1632 1216
RECTANGLE Normal 3424 1184 2448 496
RECTANGLE Normal 3424 1296 2448 1184
RECTANGLE Normal 3424 1408 2448 1296
RECTANGLE Normal 3424 1488 2448 1408
RECTANGLE Normal 1968 160 1008 -112
RECTANGLE Normal 832 3136 -2432 -192 3
RECTANGLE Normal 832 3136 -2432 1376 3

The netlist it stands for:
* Draft2.asc
C+ Vcc 0 100n
C+2 Vcc 0 100u
Q5 N002 N003 N004 0 BD139
R12 Vcc N002 270 tol=5
Q4 N003 N001 Vcc 0 BD140
Q9 N003 N005 N006 0 BC546B
R16 N003 N005 1k tol=5
R§Pot2 N005 N006 670
C4 N001 N003 100p
R6 Vcc N001 560 tol=5
R13 N004 Out+ .33
R5 Out+ N010 22k tol=5
Q2 Vcc N010 N011 0 BC546B
Q1 N001 N009 N011 0 BC546B
R4 N010 N014 1.8k tol=5
R9 N006 N020 3.3k tol=5
R10 N020 Vee 3.3k tol=5
Q6 N017 N006 N012 0 BD140
C6 N006 N017 300p
R14 Out+ N012 .33
Q8 N012 N017 Vee 0 TIP35
R11 N017 Vee 270 tol=5
R15 Out+ N013 10
C7 N013 0 100n
C- 0 Vee 100n
Q3 N011 N019 N023 0 BC546B
R2 N008 0 22k tol=5
R3 N009 N008 1k tol=5
C10 N008 0 100p
R1 N008 N007 1k tol=5
C3 0 N014 100u
C5 Out+ N020 100u
C-2 0 Vee 100u
V1 Vcc 0 33
V2 0 Vee 33
Q7 N004 N002 Vcc 0 TIP36
C1 In+ N007 4.7u
X§Q10 N023 N023 Vee BC846BS  ; pins C B E
X§Q11 N019 N023 Vee BC846BS  ; pins C B E
R7 Vcc N019 27k tol=5
C2 Vcc 0 100n
C8 Vcc 0 100u
Q12 N057 N055 N054 0 BD139
R8 Vcc N057 270 tol=5
Q13 N055 N056 Vcc 0 BD140
Q14 N055 N053 N040 0 BC546B
R17 N055 N053 1k tol=5
R§Pot1 N053 N040 670
C9 N056 N055 100p
R18 Vcc N056 560 tol=5
R19 N054 Out- .33
R20 Out- N049 22k
Q15 Vcc N049 N044 0 BC546B
Q16 N056 N048 N044 0 BC546B
R21 N049 N041 1.8k tol=5
R22 N040 N037 3.3k tol=5
R23 N037 Vee 3.3k tol=5
Q17 N038 N040 N042 0 BD140
C11 N040 N038 300p
R24 Out- N042 .33
Q18 N042 N038 Vee 0 TIP35
R25 N038 Vee 270 tol=5
R26 Out- N043 10
C12 N043 0 100n
C13 0 Vee 100n
Q19 N044 N036 N033 0 BC546B
R27 N045 0 22k tol=5
R28 N048 N045 1k tol=5
C14 N045 0 100p
R29 N045 N047 1k tol=5
C15 0 N041 100u
C16 Out- N037 100u
C17 0 Vee 100u
Q20 N054 N057 Vcc 0 TIP36
C18 In- N047 4.7u
X§Q21 N033 N033 Vee BC846BS  ; pins C B E
X§Q22 N036 N033 Vee BC846BS  ; pins C B E
R30 Vcc N036 27k tol=5
R31 Out+ Out- 8
V3 Vpos 0 15
V4 0 Vneg 15
R32 N018 N016 3.3k tol=5
R§POT3 N024 N018 10k
R§POT4 N025 N024 1
C19 N024 N028 5u
C20 N028 N031 23n
R33 N031 0 100k
R34 N029 N028 470 tol=5
R35 In+ N025 10k
X§U1 N031 N029 Vpos Vneg N029 TL081  ; pins In+ In- V+ V- OUT
X§U2 N018 N025 Vpos Vneg In+ TL081  ; pins In+ In- V+ V- OUT
X§U3 0 N030 Vpos Vneg In- TL081  ; pins In+ In- V+ V- OUT
R36 N030 In+ 10k tol=5
R37 In- N030 10k tol=5
V5 N021 0 SINE(0 700m 1k) AC 1
V6 N026 0 SINE(0 700m 1k) AC 1
C21 N021 N022 4.7u
C22 N026 N027 4.7u
R38 N015 N022 10k tol=5
R39 N015 N027 10k tol=5
X§TL1 0 N015 Vpos Vneg N016 level2 Avol=1Meg GBW=10Meg Slew=10Meg Ilimit=25m Rail=0 Vos=0 En=0 Enk=0 In=0 Ink=0 Rin=500Meg  ; pins In+ In- V+ V- OUT
R40 N016 N015 470 tol=5
R§POT5 N032 N018 10k
R§POT6 N025 N032 1
C23 N032 N034 .4u
C24 N034 N039 1.4n
R41 N039 0 100k
R42 N035 N034 470 tol=5
X§U4 N039 N035 Vpos Vneg N035 TL081  ; pins In+ In- V+ V- OUT
R§10k N046 N018 5k
R§POT8 N025 N046 1
C25 N046 N050 25n
C26 N050 N052 85p
R43 N052 0 100k
R44 N051 N050 470 tol=5
X§U5 N052 N051 Vpos Vneg N051 TL081  ; pins In+ In- V+ V- OUT
.model NPN NPN
.model PNP PNP
.lib standard.bjt
.model TIP35 NPN (IS=1.84P NF=1 BF=81.5 VAF=161 IKF=8.33 ISE=1.97N NE=2
+ BR=4 NR=1 VAR=20 IKR=12.5 RE=13.2M RB=53M RC=5.3M XTB=1.5
+ CJE=801P VJE=.6 MJE=.3 CJC=520P VJC=.22 MJC=.2 TF=54.1N TR=2.08U)
.model TIP36 PNP (IS=1.84P NF=1 BF=65 VAF=161 IKF=8.33 ISE=2.47N NE=2
+ BR=4 NR=1 VAR=20 IKR=12.5 RE=13.2M RB=53M RC=5.3M XTB=1.5
+ CJE=1.81N VJE=.6 MJE=.3 CJC=1.17N VJC=.22 MJC=.2 TF=54.1N TR=2.08U)
* ---------- BD139 as normal BJT model ----------
.model BD139 NPN (
+ IS=0.271E-16
+ BF=204.072
+ VAF=158.022
+ IKF=5.018
+ ISE=0.137E-17
+ NE=1.712
+ BR=1.127
+ VAR=10.749
+ IKR=0.435
+ ISC=0.128E-17
+ NC=1.046
+ NK=0.207
+ RB=0.571
+ RBM=0.101E-02
+ NF=0.982
+ RE=0.259E-01
+ RC=0.413E-01
+ QCO=0.873E-10
+ RCO=4.999
+ VO=6.291
+ GAMMA=0.704E-10
+ CJC=0.361E-10
+ VJC=0.776
+ MJC=0.409
+ CJE=0.102E-10
+ VJE=0.745
+ MJE=0.404
+ FC=0.503
+ TR=0.118E-06
+ TF=0.296E-08
+ ITF=0.229
+ VTF=23.728
+ XTF=0.569
+)
* ---------- BD140 as normal BJT model ----------
.model BD140 PNP (
+ IS=0.188E-16
+ BF=201.325
+ VAF=39.764
+ IKF=0.521
+ ISE=0.447E-15
+ NE=2.771
+ BR=0.671E-01
+ VAR=131.148
+ IKR=0.494
+ ISC=0.921E-12
+ NC=1.674
+ NK=0.515
+ RB=0.572E-01
+ RBM=0.335E-02
+ NF=0.981
+ RE=0.185E-02
+ RC=0.127
+ QCO=0.214E-09
+ RCO=1.681
+ VO=10.359
+ GAMMA=0.579E-10
+ CJC=0.469E-12
+ VJC=0.715
+ MJC=0.313
+ CJE=0.297E-12
+ VJE=0.735
+ MJE=0.384
+ FC=0.526
+ TR=0.129E-07
+ TF=0.849E-10
+ ITF=0.332
+ VTF=6.784
+ XTF=0.505
+)
* .ac dec 100 1 100k
.include BC846.lib
**************************************
*      Model Generated by MODPEX     *
*Copyright(c) Symmetry Design Systems*
*         All Rights Reserved        *
*    UNPUBLISHED LICENSED SOFTWARE   *
*   Contains Proprietary Information *
*      Which is The Property of      *
*     SYMMETRY OR ITS LICENSORS      *
*Commercial Use or Resale Restricted *
*   by Symmetry License Agreement    *
**************************************
* Model generated on Feb  6, 08
* MODEL FORMAT: PSpice
.MODEL NJW1302G pnp
+IS=5.45163e-13 BF=100.173 NF=0.981788 VAF=10
+IKF=4.32732 ISE=6.43606e-12 NE=1.46233 BR=0.562437
+NR=1.095 VAR=100 IKR=0.0147402 ISC=6.43606e-12
+NC=1.3691 RB=3.70218 IRB=0.1 RBM=0.163972
+RE=0.00611492 RC=0.0305746 XTB=1.67324 XTI=1
+EG=1.05 CJE=1.1214e-08 VJE=0.663546 MJE=0.32843
+TF=2.35244e-09 XTF=79.0726 VTF=4.60515 ITF=95.9461
+CJC=5e-10 VJC=0.95 MJC=0.23 XCJC=0.901894
+FC=0.8 CJS=0 VJS=0.75 MJS=0.5
+TR=1e-07 PTF=0 KF=0 AF=1
**************************************
*      Model Generated by MODPEX     *
*Copyright(c) Symmetry Design Systems*
*         All Rights Reserved        *
*    UNPUBLISHED LICENSED SOFTWARE   *
*   Contains Proprietary Information *
*      Which is The Property of      *
*     SYMMETRY OR ITS LICENSORS      *
*Commercial Use or Resale Restricted *
*   by Symmetry License Agreement    *
**************************************
* Model generated on Feb  6, 08
* MODEL FORMAT: PSpice
.MODEL NJW3281G npn
+IS=4.81888e-11 BF=119.415 NF=1.06881 VAF=21.6596
+IKF=10 ISE=1e-16 NE=1 BR=10.3886
+NR=1.06797 VAR=216.596 IKR=3.27392 ISC=1e-16
+NC=2.90616 RB=4.74135 IRB=0.1 RBM=1.57648
+RE=0.0001 RC=0.0383617 XTB=0.1 XTI=1
+EG=1.206 CJE=9.32161e-09 VJE=0.523647 MJE=0.322215
+TF=1.817e-09 XTF=1000 VTF=15.2293 ITF=121.9
+CJC=5e-10 VJC=0.8 MJC=0.23 XCJC=0.1
+FC=0.8 CJS=0 VJS=0.75 MJS=0.5
+TR=1e-07 PTF=0 KF=0 AF=1
* TL081 OPERATIONAL AMPLIFIER "MACROMODEL" SUBCIRCUIT
* CREATED USING PARTS RELEASE 4.01 ON 06/16/89 AT 13:08
* (REV N/A)      SUPPLY VOLTAGE: +/-15V
* CONNECTIONS:   NON-INVERTING INPUT
*                | INVERTING INPUT
*                | | POSITIVE POWER SUPPLY
*                | | | NEGATIVE POWER SUPPLY
*                | | | | OUTPUT
*                | | | | |
.SUBCKT TL081    1 2 3 4 5
*
  C1   11 12 3.498E-12
  C2    6  7 15.00E-12
  DC    5 53 DX
  DE   54  5 DX
  DLP  90 91 DX
  DLN  92 90 DX
  DP    4  3 DX
  EGND 99  0 POLY(2) (3,0) (4,0) 0 .5 .5
  FB    7 99 POLY(5) VB VC VE VLP VLN 0 4.715E6 -5E6 5E6 5E6 -5E6
  GA    6  0 11 12 282.8E-6
  GCM   0  6 10 99 8.942E-9
  ISS   3 10 DC 195.0E-6
  HLIM 90  0 VLIM 1K
  J1   11  2 10 JX
  J2   12  1 10 JX
  R2    6  9 100.0E3
  RD1   4 11 3.536E3
  RD2   4 12 3.536E3
  RO1   8  5 150
  RO2   7 99 150
  RP    3  4 2.143E3
  RSS  10 99 1.026E6
  VB    9  0 DC 0
  VC    3 53 DC 2.200
  VE   54  4 DC 2.200
  VLIM  7  8 DC 0
  VLP  91  0 DC 25
  VLN   0 92 DC 25
.MODEL DX D(IS=800.0E-18)
.MODEL JX PJF(IS=15.00E-12 BETA=270.1E-6 VTO=-1)
.ENDS
.options plotwinsize=0
.tran 0 50m 40m 250n
.four 1k V(Out+) V(Out-)
* .noise V(Out+,Out-) V6 dec 100 20 20k
* .op
* EQUILISER
* ANALYSIS AND MODELS
* POWER SUPPLIES
* POWER AMP(BRIDGE TIED)
* A
* B
.lib UniversalOpAmp2.lib
.backanno
.end

* Results of the author's LTspice run, read from the files saved beside the schematic
* Operating Point, zero values left out:
*   V(in+) = 69.62 µV
*   V(in-) = -47.23 µV
*   V(n001) = 32.17 V
*   V(n002) = 32.37 V
*   V(n003) = 795.9 mV
*   V(n004) = -28.8 mV
*   V(n005) = -225.9 mV
*   V(n006) = -901.4 mV
*   V(n007) = -76.3 mV
*   V(n008) = -76.3 mV
*   V(n009) = -79.77 mV
*   V(n010) = -96.38 mV
*   V(n011) = -718.4 mV
*   V(n012) = -82.07 mV
*   V(n013) = -55.44 mV
*   V(n014) = -96.38 mV
*   V(n017) = -32.37 V
*   V(n018) = 14.33 µV
*   V(n019) = -31.68 V
*   V(n020) = -16.95 V
*   V(n023) = -32.33 V
*   V(n024) = 25.3 µV
*   V(n025) = 25.3 µV
*   V(n028) = 6.465 µV
*   V(n029) = 6.465 µV
*   V(n030) = 10.97 µV
*   V(n031) = -4.505 µV
*   V(n032) = 25.3 µV
*   V(n033) = -32.33 V
*   V(n034) = 6.465 µV
*   V(n035) = 6.465 µV
*   V(n036) = -31.68 V
*   V(n037) = -16.95 V
*   V(n038) = -32.37 V
*   V(n039) = -4.505 µV
*   V(n040) = -901.4 mV
*   V(n041) = -96.38 mV
*   V(n042) = -82.07 mV
*   V(n043) = -55.44 mV
*   V(n044) = -718.4 mV
*   V(n045) = -76.3 mV
*   V(n046) = 25.3 µV
*   V(n047) = -76.3 mV
*   V(n048) = -79.77 mV
*   V(n049) = -96.38 mV
*   V(n050) = 6.465 µV
*   V(n051) = 6.465 µV
*   V(n052) = -4.505 µV
*   V(n053) = -225.9 mV
*   V(n054) = -28.8 mV
*   V(n055) = 795.9 mV
*   V(n056) = 32.17 V
*   V(n057) = 32.37 V
*   V(out+) = -55.44 mV
*   V(out-) = -55.44 mV
*   V(vcc) = 33 V
*   V(vee) = -33 V
*   V(vneg) = -15 V
*   V(vpos) = 15 V
*   I(10k) = 2.194 nA
*   I(POT3) = 1.097 nA
*   I(POT4) = 1.097 nA
*   I(POT5) = 1.097 nA
*   I(POT6) = 1.097 nA
*   I(POT8) = 2.194 nA
*   I(Pot1) = 1.008 mA
*   I(Pot2) = 1.008 mA
*   I(R10) = 4.863 mA
*   I(R11) = 2.333 mA
*   I(R12) = 2.333 mA
*   I(R13) = 80.73 mA
*   I(R14) = 80.72 mA
*   I(R16) = 1.022 mA
*   I(R17) = 1.022 mA
*   I(R18) = 1.478 mA
*   I(R19) = 80.73 mA
*   I(R2) = -3.468 µA
*   I(R20) = 1.861 µA
*   I(R22) = 4.863 mA
*   I(R23) = 4.863 mA
*   I(R24) = 80.72 mA
*   I(R25) = 2.333 mA
*   I(R27) = -3.468 µA
*   I(R28) = -3.468 µA
*   I(R3) = -3.468 µA
*   I(R30) = 2.396 mA
*   I(R32) = 4.342 nA
*   I(R33) = -45.05 pA
*   I(R35) = 4.432 nA
*   I(R36) = -5.865 nA
*   I(R37) = -5.82 nA
*   I(R41) = -45.05 pA
*   I(R43) = -45.05 pA
*   I(R5) = 1.861 µA
*   I(R6) = 1.478 mA
*   I(R7) = 2.396 mA
*   I(R8) = 2.333 mA
*   I(R9) = 4.863 mA
*   I(V1) = -180.5 mA
*   I(V2) = -180.6 mA
*   I(V3) = -72.47 mA
*   I(V4) = -72.47 mA
*   Ib(Q1) = 3.468 µA
*   Ib(Q12) = 16.68 µA
*   Ib(Q13) = -13.64 µA
*   Ib(Q14) = 13.6 µA
*   Ib(Q15) = 1.861 µA
*   Ib(Q16) = 3.468 µA
*   Ib(Q17) = -9.845 µA
*   Ib(Q18) = 1.191 mA
*   Ib(Q19) = 5.453 µA
*   Ib(Q2) = 1.861 µA
*   Ib(Q20) = -1.488 mA
*   Ib(Q3) = 5.453 µA
*   Ib(Q4) = -13.64 µA
*   Ib(Q5) = 16.68 µA
*   Ib(Q6) = -9.845 µA
*   Ib(Q7) = -1.488 mA
*   Ib(Q8) = 1.191 mA
*   Ib(Q9) = 13.6 µA
*   Ic(Q1) = 1.491 mA
*   Ic(Q12) = 3.82 mA
*   Ic(Q13) = -4.87 mA
*   Ic(Q14) = 3.832 mA
*   Ic(Q15) = 808.8 µA
*   Ic(Q16) = 1.491 mA
*   Ic(Q17) = -3.524 mA
*   Ic(Q18) = 77.19 mA
*   Ic(Q19) = 2.306 mA
*   Ic(Q2) = 808.8 µA
*   Ic(Q20) = -76.89 mA
*   Ic(Q3) = 2.306 mA
*   Ic(Q4) = -4.87 mA
*   Ic(Q5) = 3.82 mA
*   Ic(Q6) = -3.524 mA
*   Ic(Q7) = -76.89 mA
*   Ic(Q8) = 77.19 mA
*   Ic(Q9) = 3.832 mA
*   Ie(Q1) = -1.495 mA
*   Ie(Q12) = -3.837 mA
*   Ie(Q13) = 4.884 mA
*   Ie(Q14) = -3.845 mA
*   Ie(Q15) = -810.7 µA
*   Ie(Q16) = -1.495 mA
*   Ie(Q17) = 3.534 mA
*   Ie(Q18) = -78.38 mA
*   Ie(Q19) = -2.311 mA
*   Ie(Q2) = -810.7 µA
*   Ie(Q20) = 78.38 mA
*   Ie(Q3) = -2.311 mA
*   Ie(Q4) = 4.884 mA
*   Ie(Q5) = -3.837 mA
*   Ie(Q6) = 3.534 mA
*   Ie(Q7) = 78.38 mA
*   Ie(Q8) = -78.38 mA
*   Ie(Q9) = -3.845 mA
* From the log:
*   Fourier components of V(Out+)
*   N-Period=1
*   DC component:-0.0584051
*   Harmonic  Frequency   Fourier   Normalized   Phase    Normalized
*    Number     [Hz]     Component   Component  [degree]  Phase [deg]
*       1      1.000e+03   1.864e+01   1.000e+00    -88.00°      0.00°
*       2      2.000e+03   1.667e-03   8.944e-05      0.86°     88.86°
*       3      3.000e+03   6.625e-04   3.555e-05    -84.61°      3.39°
*       4      4.000e+03   6.642e-05   3.564e-06      1.95°     89.95°
*       5      5.000e+03   1.244e-05   6.674e-07     52.97°    140.97°
*       6      6.000e+03   2.145e-05   1.151e-06     -2.29°     85.71°
*       7      7.000e+03   4.789e-06   2.570e-07    -31.82°     56.18°
*       8      8.000e+03   1.351e-05   7.251e-07     -5.84°     82.16°
*       9      9.000e+03   1.597e-06   8.568e-08    -71.73°     16.27°
*   Partial Harmonic Distortion: 0.009633%
*   Total Harmonic Distortion:   0.009644%
*   Fourier components of V(Out-)
*   N-Period=1
*   DC component:-0.0563787
*   Harmonic  Frequency   Fourier   Normalized   Phase    Normalized
*    Number     [Hz]     Component   Component  [degree]  Phase [deg]
*       1      1.000e+03   1.863e+01   1.000e+00     92.04°      0.00°
*       2      2.000e+03   1.650e-03   8.854e-05      1.94°    -90.09°
*       3      3.000e+03   6.626e-04   3.556e-05     95.44°      3.40°
*       4      4.000e+03   6.663e-05   3.575e-06      5.03°    -87.00°
*       5      5.000e+03   1.240e-05   6.653e-07   -127.10°   -219.13°
*       6      6.000e+03   2.149e-05   1.153e-06      4.22°    -87.82°
*       7      7.000e+03   4.788e-06   2.570e-07    148.19°     56.16°
*       8      8.000e+03   1.345e-05   7.217e-07      1.92°    -90.12°
*       9      9.000e+03   1.643e-06   8.815e-08    108.63°     16.60°
*   Partial Harmonic Distortion: 0.009549%
*   Total Harmonic Distortion:   0.009560%